# Altium schematic sheet TLM_002_LoRa.SchDoc: =DocumentName
size A4; CompanyName: Scopa Industries LLC; Engineer: Nazar Lysenko / Andrii Antonenko; Organization: Scopa Industries LLC; Address1: Kyiv; Address2: Ukraine; Address3: https://www.scopa.industries/; Address4: oleksyi.y@scopa.industries; SheetNumber: 10; SheetTotal: 11
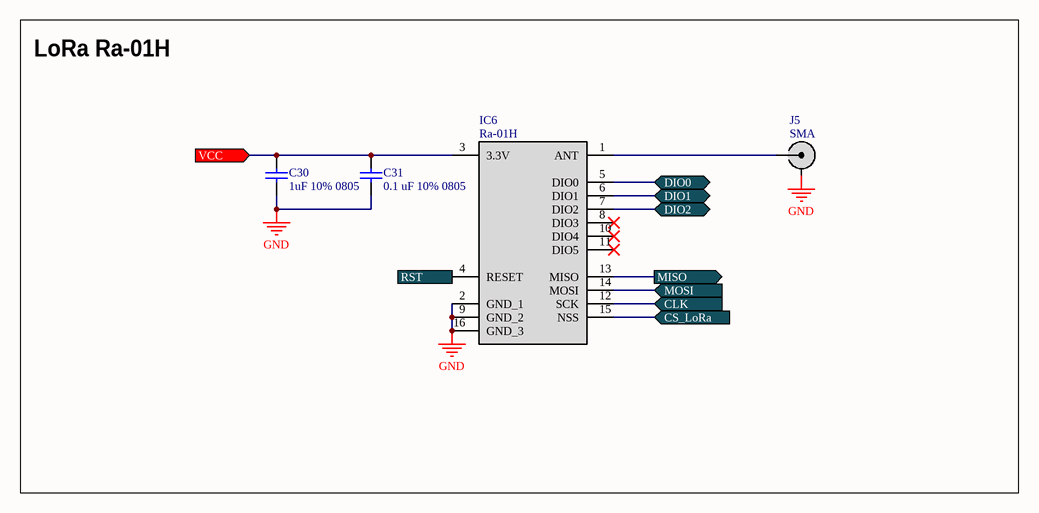
[diagram p0: TLM_002_LoRa.SchDoc]

## Parts
C30  1uF 10% 0805  [CAPC2013X145X50NL20T20]
C31  0.1 uF 10% 0805  [CAPC2013X140X50ML20T25]
IC6  Ra-01H  [Ra01H]
J5  SMA  [FP-5-1814400-2-MFG]

## Ports
CLK (in, see TLM_002_MBR[2A]), CS_LoRa (in, see TLM_002_MBR[2A]), DIO0 (bidir, see TLM_002_MBR[2A]), DIO1 (bidir, see TLM_002_MBR[2B]), DIO2 (bidir, see TLM_002_MBR[2B]), MISO (out, see TLM_002_MBR[2A]), MOSI (in, see TLM_002_MBR[2A]), RST (in, see TLM_002_MBR[2B]), VCC (in, see TLM_002_MBR[2A], TLM_002_DS3231SN_RTC[2B], TLM_002_ESP32S3[1A], TLM_002_INA228[1B], TLM_002_MAX6675[2B], TLM_002_MAX31856[1B], TLM_002_SD[1B])

## Nets
GND: C30.1 C31.1 IC6.2(GND_1) IC6.9(GND_2) IC6.16(GND_3) J5.2
CLK: IC6.12(SCK) ; port CLK
CS_LoRa: IC6.15(NSS) ; port CS_LoRa
DIO0: IC6.5(DIO0) ; port DIO0
DIO1: IC6.6(DIO1) ; port DIO1
DIO2: IC6.7(DIO2) ; port DIO2
MISO: IC6.13(MISO) ; port MISO
MOSI: IC6.14(MOSI) ; port MOSI
RST: IC6.4(RESET) ; port RST
VCC: C30.2 C31.2 IC6.3(3.3V) ; port VCC
NetIC6_1: IC6.1(ANT) J5.1

Not connected (* = marked no-connect by the designer): IC6 8(DIO3)* 10(DIO4)* 11(DIO5)*

## Notes on the sheet
- LoRa Ra-01H
- Title
- Size:
- Date:
- A4
- Author:
- Time:
- Sheet
- Revision:
- of
- File:

## Library data of the parts
C30 = CMP-2007-01676-1: Part Number: VJ0805Y105KXQRW1BC; Manufacturer: Vitramon
C31 = CMP-2007-04651-1: Part Number: 0805DD104KAT2A; Manufacturer: AVX Interconnect / Elco
IC6 = Ra-01H: Integrated Circuit; Manufacturer_Name: Ai-Thinker; Datasheet Link: https://cdn.ozdisan.com/ETicaret_Dosya/632831_134737.pdf; Height: 3.4mm; Manufacturer_Part_Number: Ra-01H
J5 = CMP-00002-2: RF SMA Connector, 1 Contact(s), Female, Board Mount, Solder Terminal, Locking, Jack; Manufacturer Lifecycle Status: ACTIVE; Voltage Rating: 500V; Shielding: No; Impedance: 50Ω; Number of Contacts: 1; Dielectric Material: PTFE; Frequency: 3GHz; Lifecycle Status: Production; Max Operating Temperature: 85°C; RoHS: Compliant; China RoHS: Non-Compliant; Contact Gender: Female; Packaging: Tape & Reel; Schedule B: 8536694040, 8536694040; Number of Ports: 1; REACH SVHC: No; Contact Material: Gold; Min Operating Temperature: -55°C; Pins: 1; Height: 10.83mm; Number of Positions: 1